# EAGLE design Adafruit DragonTail (EAGLE 6.4)
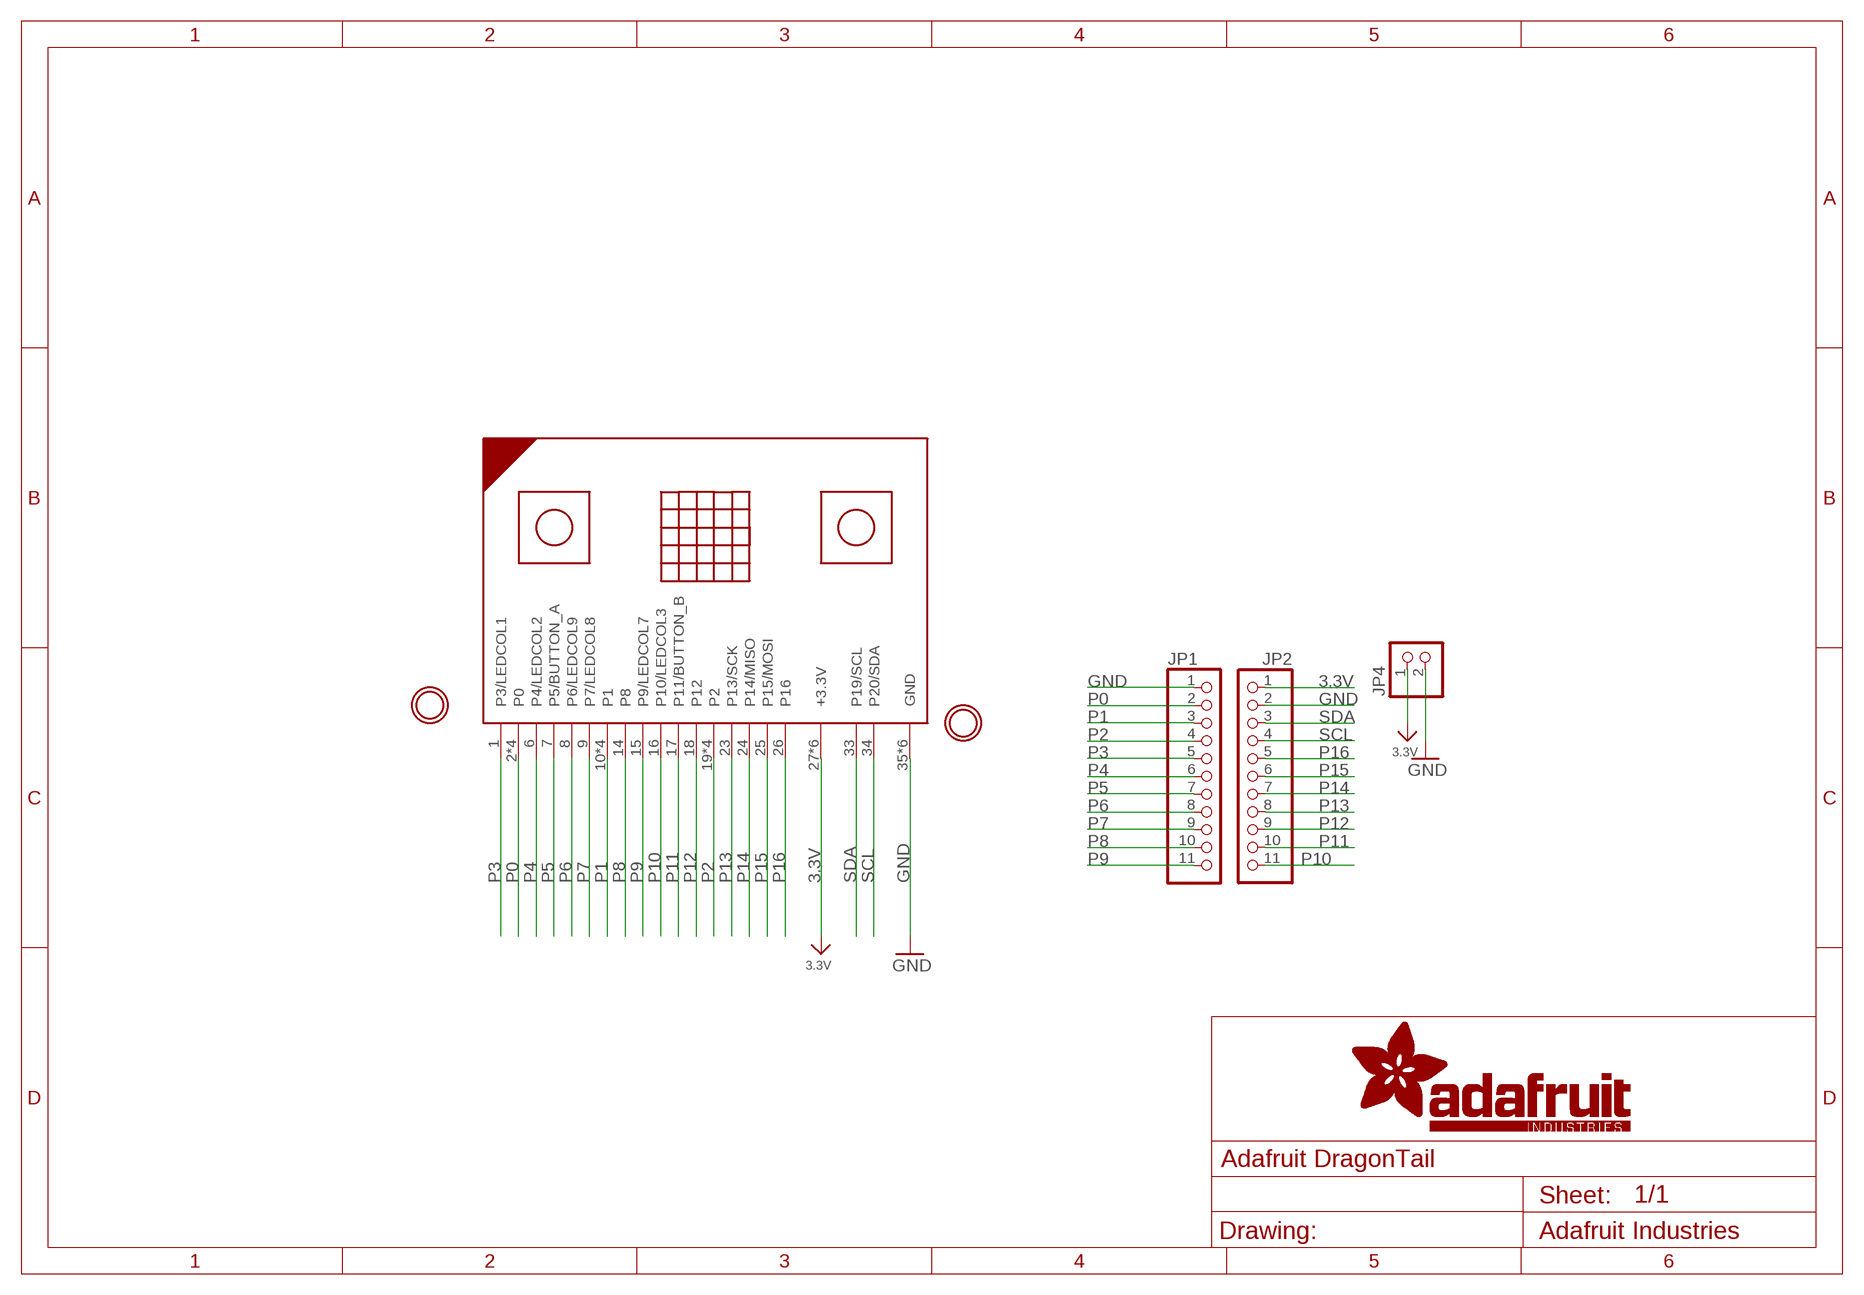
[diagram p0: schematic, sheet 1]

## Parts
JP1  HEADER-1X1176MIL  [1X11_ROUND_76]
JP2  HEADER-1X1176MIL  [1X11_ROUND_76]
JP4  HEADER-1X2  [1X02_OVAL]
MB1  MICRO:BIT_RA  [2X20_CARDEDGE_RA]
U$9  MOUNTINGHOLE2.0  [MOUNTINGHOLE_2.0_PLATED]
U$10  MOUNTINGHOLE2.0  [MOUNTINGHOLE_2.0_PLATED]

## Nets
3.3V: JP2.1 JP4.1 MB1.27(+3.3V) MB1.28(+3.3V) MB1.29(+3.3V) MB1.30(+3.3V) MB1.31(+3.3V) MB1.32(+3.3V)
GND: JP1.1 JP2.2 JP4.2 MB1.35(GND) MB1.36(GND) MB1.37(GND) MB1.38(GND) MB1.39(GND) MB1.40(GND)
P0: JP1.2 MB1.2(P0) MB1.3(P0) MB1.4(P0) MB1.5(P0)
P1: JP1.3 MB1.10(P1) MB1.11(P1) MB1.12(P1) MB1.13(P1)
P2: JP1.4 MB1.19(P2) MB1.20(P2) MB1.21(P2) MB1.22(P2)
P3: JP1.5 MB1.1(P3/LEDCOL1)
P4: JP1.6 MB1.6(P4/LEDCOL2)
P5: JP1.7 MB1.7(P5/BUTTON_A)
P6: JP1.8 MB1.8(P6/LEDCOL9)
P7: JP1.9 MB1.9(P7/LEDCOL8)
P8: JP1.10 MB1.14(P8)
P9: JP1.11 MB1.15(P9/LEDCOL7)
P10: JP2.11 MB1.16(P10/LEDCOL3)
P11: JP2.10 MB1.17(P11/BUTTON_B)
P12: JP2.9 MB1.18(P12)
P13: JP2.8 MB1.23(P13/SCK)
P14: JP2.7 MB1.24(P14/MISO)
P15: JP2.6 MB1.25(P15/MOSI)
P16: JP2.5 MB1.26(P16)
SCL: JP2.4 MB1.33(P19/SCL)
SDA: JP2.3 MB1.34(P20/SDA)

## Library data of the parts
JP1 JP2 = microbuilder:HEADER-1X11
JP4 = microbuilder:HEADER-1X2: PIN HEADER
MB1 = microbuilder:MICRO:BIT
U$9 U$10 = microbuilder:MOUNTINGHOLE: Mounting Hole For #2 screws (0.086"/2.18mm width, 0.094"/2.4mm hole) use 2.5mm; BOM: EXCLUDE

## Board
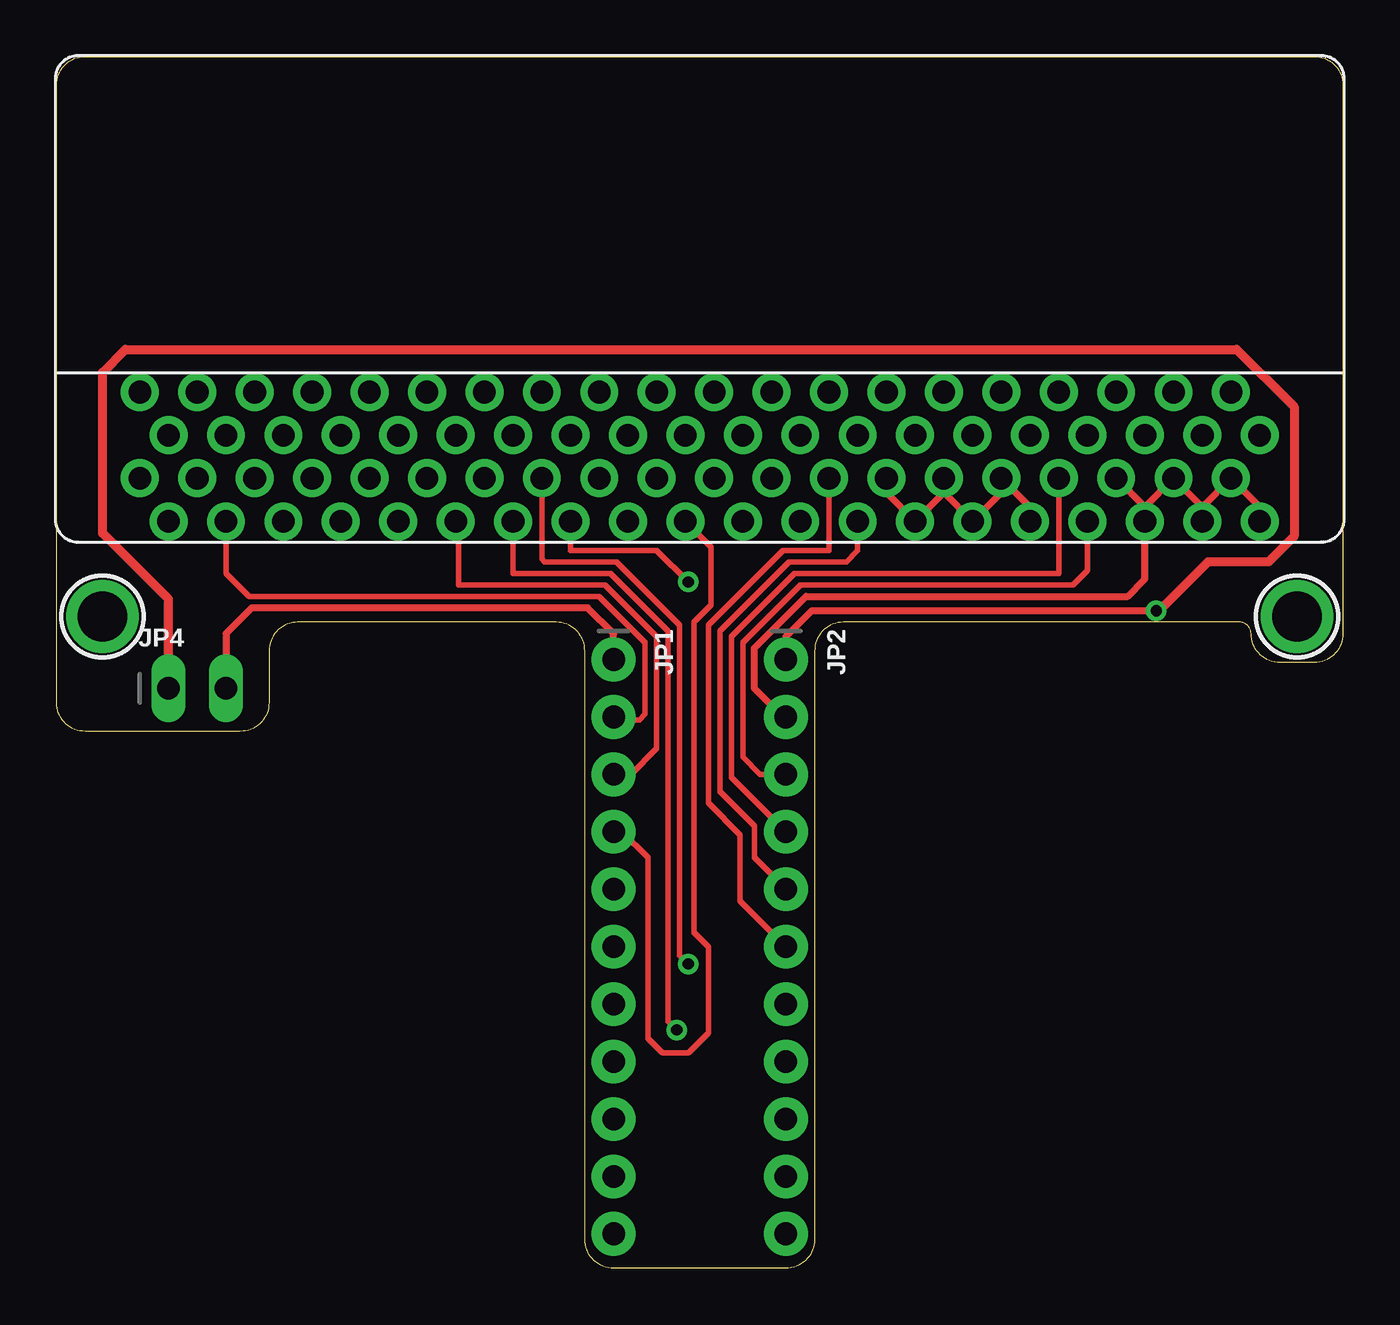
[diagram p1: board, top side]
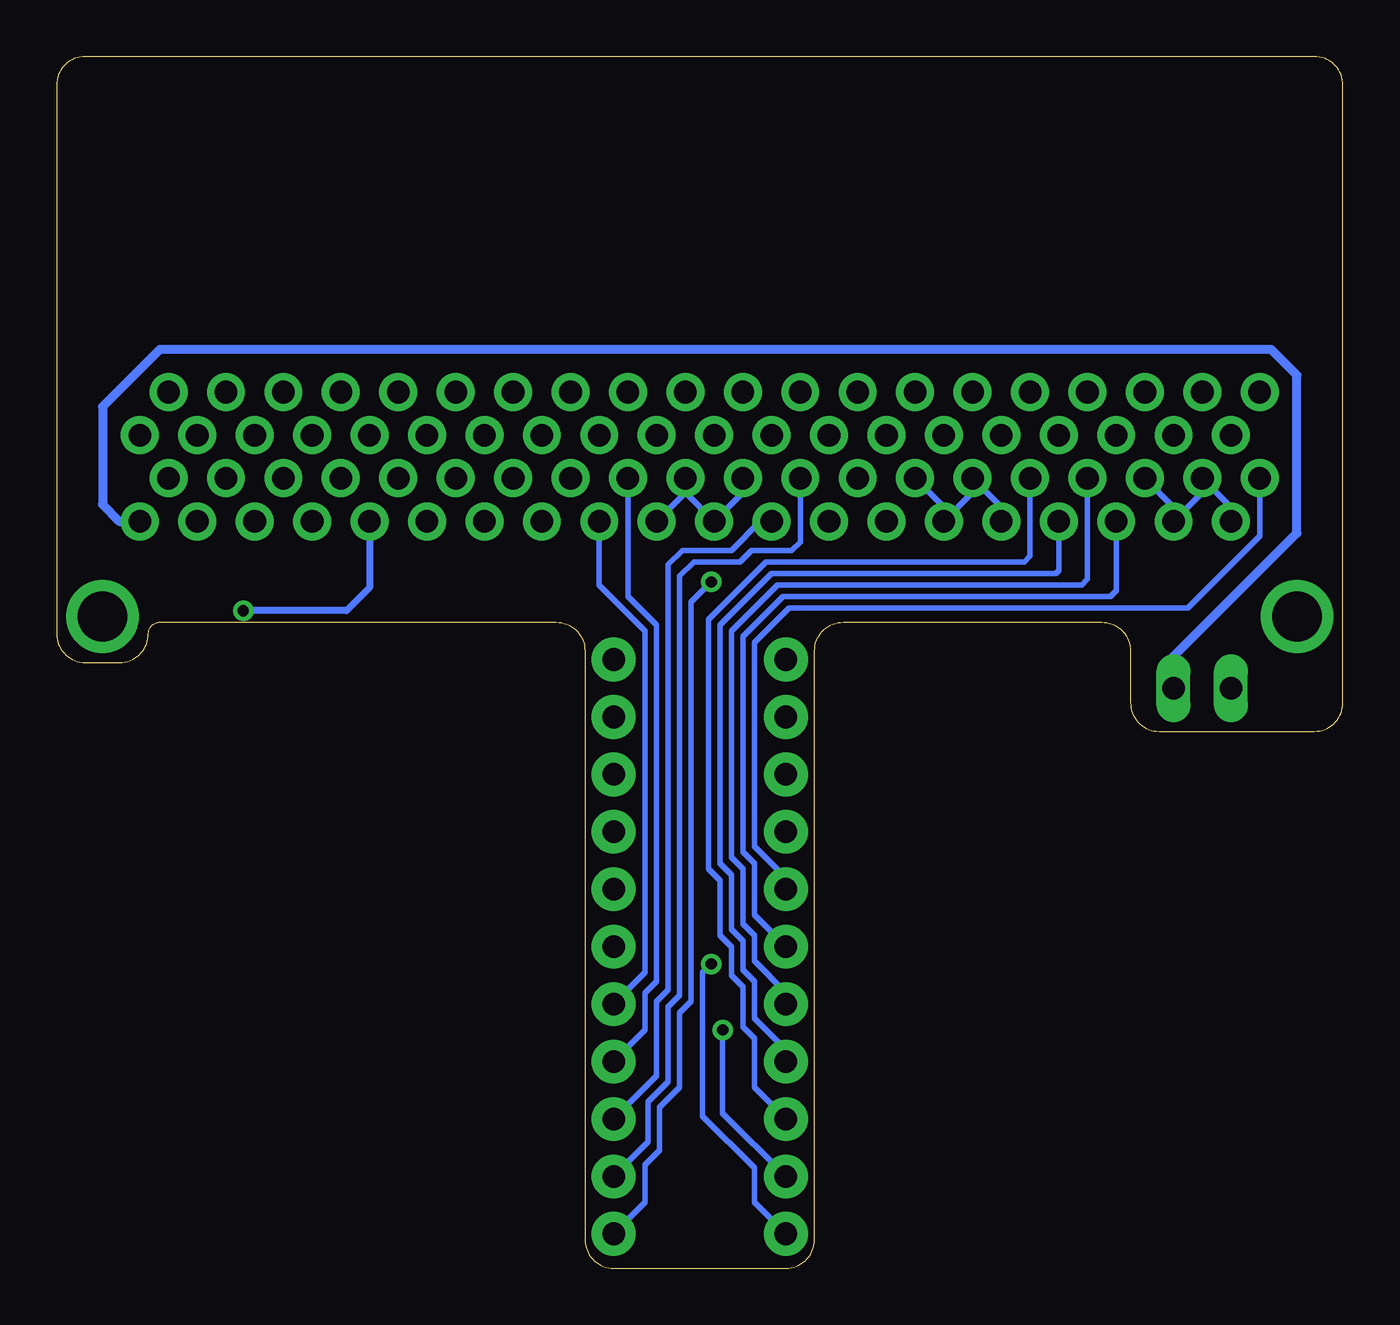
[diagram p2: board, bottom side, seen from below]

Size 56.9 x 53.59 mm. Coordinates in mm from the lower left corner, seen from the top.
Outline: 8.13,23.75 1.27,23.75 arc-90 0,25.02 0,52.32 arc-90 1.27,53.59 55.63,53.59 arc-90 56.9,52.32 56.9,28.07 arc-90 55.63,26.8 54.1,26.8 arc-90 52.83,28.07 arc90 52.32,28.58 34.8,28.58 arc90 33.53,27.3 33.53,1.27 arc-90 32.26,0 24.64,0 arc-90 23.37,1.27 23.37,27.3 arc90 22.1,28.58 10.67,28.58 arc90 9.4,27.3 9.4,25.02 arc-90 8.13,23.75
Copper layers (1*16): Top 0.035mm / dielectric 1.5mm / Bottom 0.035mm
Design rules "adafruit *": minimum track width 8mil, minimum drill 15.5mil, track to track 8mil, track to pad 8mil, pad to pad 8mil, via to via 8mil, smd to smd 8mil, copper to edge 10mil, drill to drill 8mil, minimum pad ring 10mil, minimum via ring 8mil, stop-mask expansion 2mil, vias tented up to drill 20mil, thermal gap 10mil

### Footprints (pad centres in the part's own frame; a part is rotated, then mirrored left to right if it is on the bottom)
1X11_ROUND_76 = drill 1 pad 1.93: 1 -12.7,0; 2 -10.16,0; 3 -7.62,0; 4 -5.08,0; 5 -2.54,0; 6 0,0; 7 2.54,0; 8 5.08,0; 9 7.62,0; 10 10.16,0; 11 12.7,0
1X02_OVAL = drill 1 long: 1 -1.27,0; 2 1.27,0
2X20_CARDEDGE_RA = drill 1 pad 1.676: 1 -24.765,-4.68; 2 -23.495,-6.59; 3 -22.225,-4.68; 4 -20.955,-6.59; 5 -19.685,-4.68; 6 -18.415,-6.59; 7 -17.145,-4.68; 8 -15.875,-6.59; 9 -14.605,-4.68; 10 -13.335,-6.59; 11 -12.065,-4.68; 12 -10.795,-6.59; 13 -9.525,-4.68; 14 -8.255,-6.59; 15 -6.985,-4.68; 16 -5.715,-6.59; 17 -4.445,-4.68; 18 -3.175,-6.59; 19 -1.905,-4.68; 20 -0.635,-6.59; 21 0.635,-4.68; 22 1.905,-6.59; 23 3.175,-4.68; 24 4.445,-6.59; 25 5.715,-4.68; 26 6.985,-6.59; 27 8.255,-4.68; 28 9.525,-6.59; 29 10.795,-4.68; 30 12.065,-6.59; 31 13.335,-4.68; 32 14.605,-6.59; 33 15.875,-4.68; 34 17.145,-6.59; 35 18.415,-4.68; 36 19.685,-6.59; 37 20.955,-4.68; 38 22.225,-6.59; 39 23.495,-4.68; 40 24.765,-6.59; 41 24.765,-2.78; 42 23.495,-0.87; 43 22.225,-2.78; 44 20.955,-0.87; 45 19.685,-2.78; 46 18.415,-0.87; 47 17.145,-2.78; 48 15.875,-0.87; 49 14.605,-2.78; 50 13.335,-0.87; 51 12.065,-2.78; 52 10.795,-0.87; 53 9.525,-2.78; 54 8.255,-0.87; 55 6.985,-2.78; 56 5.715,-0.87; 57 4.445,-2.78; 58 3.175,-0.87; 59 1.905,-2.78; 60 0.635,-0.87; 61 -0.635,-2.78; 62 -1.905,-0.87; 63 -3.175,-2.78; 64 -4.445,-0.87; 65 -5.715,-2.78; 66 -6.985,-0.87; 67 -8.255,-2.78; 68 -9.525,-0.87; 69 -10.795,-2.78; 70 -12.065,-0.87; 71 -13.335,-2.78; 72 -14.605,-0.87; 73 -15.875,-2.78; 74 -17.145,-0.87; 75 -18.415,-2.78; 76 -19.685,-0.87; 77 -20.955,-2.78; 78 -22.225,-0.87; 79 -23.495,-2.78; 80 -24.765,-0.87
MOUNTINGHOLE_2.0_PLATED = drill 2.2 pad 3: P$1 0,0

### Placement (x,y rotation side)
JP1  24.64,14.22 270 top
JP2  32.26,14.22 270 top
JP4  6.22,25.65 0 top
MB1  28.45,39.62 0 top
U$3  [TBREADBIT_BOT]  56.9,0 0 bottom
U$6  [TBREADBIT_TOP]  0,0 0 top
U$9  54.86,28.83 0 top
U$10  2.03,28.83 0 top

### Tracks (layer width: path | path; a pad name or v marks a point on that pad's centre or on a via)
3.3V  (via drill 0.5)
  Top 0.305: MB1.32 43.05,33.67 MB1.31 41.78,34.3 MB1.30 39.24,34.3 | MB1.29 39.24,34.3 | 39.24,34.3 MB1.28 36.7,34.3 MB1.27 | JP2.1 32.26,27.94 33.4,29.08 v48.64,29.08
  Top 0.406: JP4.1 4.95,29.59 2.03,32.51 2.03,39.62 3.05,40.64 52.2,40.64 54.74,38.1 54.74,32.39 53.59,31.24 50.93,31.24 48.77,29.08 v48.64,29.08
  Bottom 0.305: MB1.32 43.05,30.1 44.07,29.08 48.51,29.08
  Bottom 0.406: 48.51,29.08 v48.64,29.08
GND
  Top 0.305: MB1.40 53.21,33.67 MB1.39 50.67,33.67 | 50.67,33.67 MB1.37 48.13,33.67 | 50.67,33.67 MB1.38 | MB1.35 48.13,33.67 | 48.13,33.67 MB1.36 48.13,30.48 47.37,29.72 33.15,29.72 30.86,27.43 30.86,25.65 32.13,24.38 JP2.2 | JP1.1 24.64,28.07 23.5,29.21 8.64,29.21 7.49,28.07 JP4.2
  Bottom 0.406: JP4.2 7.49,27.05 2.03,32.51 2.03,39.5 3.18,40.64 52.32,40.64 54.86,38.1 54.86,33.78 54.12,33.03 MB1.40
P0
  Top 0.254: MB1.4 7.49,30.73 8.51,29.72 24,29.72 26.04,27.69 26.04,24.51 25.78,24.26 24.77,24.26 JP1.2
  Bottom 0.254: MB1.2 4.95,33.67 MB1.3 6.22,34.3 MB1.4 7.49,33.67 MB1.5
P1
  Top 0.254: JP1.3 25.4,21.84 26.54,22.99 26.54,27.94 24.26,30.23 17.78,30.23 17.78,32.91 MB1.12
  Bottom 0.254: MB1.10 15.11,33.67 MB1.11 16.38,34.3 MB1.12 17.65,33.67 MB1.13
P2
  Top 0.254: MB1.20 28.96,31.89 28.96,29.34 28.19,28.58 28.19,14.86 28.83,14.22 28.83,10.41 27.94,9.53 26.8,9.53 26.16,10.16 26.16,18.16 25.02,19.3 JP1.4
  Bottom 0.254: 29.08,34.3 MB1.22 | MB1.21 29.08,34.3 | 29.08,34.3 MB1.20 26.54,34.3 MB1.19
P3
  Bottom 0.254: MB1.1 3.68,32.39 6.86,29.21 24.51,29.21 26.04,27.69 26.04,18.67 24.64,17.27 JP1.5
P4
  Bottom 0.254: MB1.6 10.03,29.97 10.29,29.72 24.77,29.72 26.54,27.94 26.54,18.42 26.04,17.91 26.04,15.62 JP1.6
P5
  Bottom 0.254: MB1.7 11.3,30.48 11.56,30.23 25.02,30.23 27.05,28.19 27.05,18.16 26.54,17.65 26.54,15.24 26.04,14.73 26.04,13.59 24.64,12.19 JP1.7
P6
  Bottom 0.254: MB1.8 12.57,30.86 12.7,30.73 25.27,30.73 27.56,28.45 27.56,17.91 27.05,17.4 27.05,14.99 26.54,14.48 26.54,13.21 26.04,12.7 26.04,11.05 24.64,9.65 JP1.8
P7
  Bottom 0.254: MB1.9 13.84,31.5 14.1,31.24 25.53,31.24 28.07,28.7 28.07,17.65 27.56,17.15 27.56,14.73 27.05,14.22 27.05,12.95 26.54,12.45 26.54,10.67 26.04,10.16 26.04,8 JP1.9
P8  (via drill 0.5)
  Top 0.254: MB1.14 20.19,30.73 24.51,30.73 27.05,28.19 27.05,10.92 v27.43,10.54
  Bottom 0.254: v27.43,10.54 27.43,6.86 JP1.10
P9  (via drill 0.5)
  Top 0.254: MB1.15 21.46,31.37 21.59,31.24 24.77,31.24 27.56,28.45 27.56,13.84 v27.94,13.46
  Bottom 0.254: v27.94,13.46 28.32,13.08 28.32,6.73 26.04,4.45 26.04,2.92 JP1.11
P10  (via drill 0.5)
  Top 0.254: MB1.16 22.73,31.75 26.54,31.75 v27.94,30.35
  Bottom 0.254: v27.94,30.35 28.83,29.46 28.83,11.81 29.34,11.3 29.34,8 30.23,7.11 30.23,5.21 30.86,4.57 30.86,2.92 JP2.11
P11
  Bottom 0.254: MB1.17 24,32.13 24.38,31.75 26.16,31.75 26.67,31.24 28.7,31.24 29.34,30.61 29.34,12.07 29.84,11.56 29.84,8.26 30.73,7.37 30.73,5.59 JP2.10
P12
  Bottom 0.254: 25.64,33.03 MB1.18 25.29,33.02 25.78,33.02 27.05,31.75 29.21,31.75 29.84,31.12 29.84,12.32 30.35,11.81 30.35,8.51 JP2.9
P13
  Bottom 0.254: MB1.23 31.62,29.72 30.35,28.45 30.35,12.7 30.86,12.19 30.86,10.54 JP2.8
P14
  Bottom 0.254: MB1.24 32.89,30.23 30.86,28.19 30.86,13.08 JP2.7
P15
  Top 0.254: MB1.25 34.16,31.75 32.13,31.75 28.83,28.45 28.83,20.57 30.23,19.18 30.23,16.26 JP2.6
P16
  Top 0.254: MB1.26 35.43,31.75 34.92,31.24 32.38,31.24 29.34,28.19 29.34,21.08 30.86,19.56 30.86,18.16 JP2.5
SCL
  Top 0.254: MB1.33 44.32,30.73 32.64,30.73 29.84,27.94 29.84,21.72 JP2.4
SDA
  Top 0.254: MB1.34 45.59,30.86 44.96,30.23 32.89,30.23 30.35,27.69 30.35,22.61 31.12,21.84 JP2.3